# Altium schematic sheet Programer Connectors_SPI.SchDoc
size 50 x 30 mm
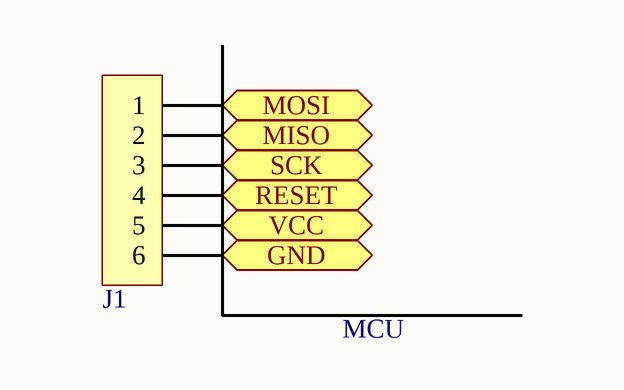
[diagram p0: Programer Connectors_SPI.SchDoc]

## Parts
J1  Connector_6pin  [HDR1X6]  (value not drawn)

## Ports
GND (in), MISO (out), MOSI (out), RESET (out), SCK (out), VCC (in)

## Nets
GND: J1.6 ; port GND
MISO: J1.2 ; port MISO
MOSI: J1.1 ; port MOSI
RESET: J1.4 ; port RESET
SCK: J1.3 ; port SCK
VCC: J1.5 ; port VCC

## Notes on the sheet
- MCU

## Library data of the parts
J1 = Connector_6pin: Header, 6-Pin; Manufacturer: Generic Components; Revision: July-2002: Re-released for DXP Platform.; Publisher: Altium Limited; Class I: Connector